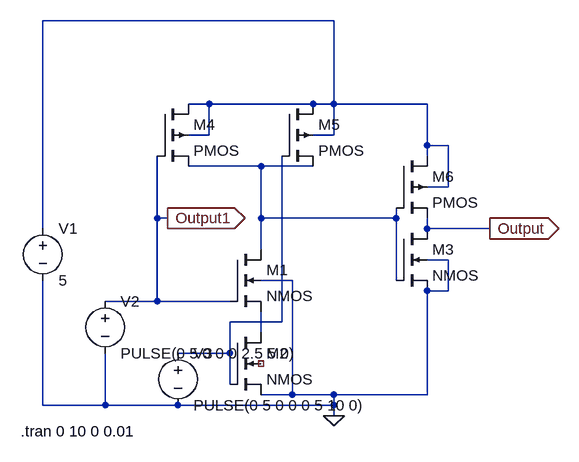
[diagram p0: schematic and.asc]
and.asc, the LTspice schematic file:
Version 4
SHEET 1 880 680
WIRE 256 -272 -192 -272
WIRE 64 -144 32 -144
WIRE 224 -144 64 -144
WIRE 256 -144 256 -272
WIRE 256 -144 224 -144
WIRE 400 -144 256 -144
WIRE 64 -96 64 -144
WIRE 64 -96 32 -96
WIRE 256 -96 256 -144
WIRE 256 -96 224 -96
WIRE 400 -80 400 -144
WIRE 432 -80 400 -80
WIRE 400 -64 400 -80
WIRE 144 -48 32 -48
WIRE 224 -48 144 -48
WIRE 432 -16 432 -80
WIRE 432 -16 400 -16
WIRE -16 32 -16 -64
WIRE 0 32 -16 32
WIRE 144 32 144 -48
WIRE 352 32 352 16
WIRE 352 32 144 32
WIRE -192 48 -192 -272
WIRE 400 48 400 32
WIRE 496 48 400 48
WIRE 144 80 144 32
WIRE 432 96 400 96
WIRE 192 128 144 128
WIRE 352 128 352 32
WIRE 432 144 432 96
WIRE 432 144 400 144
WIRE -16 160 -16 32
WIRE -16 160 -96 160
WIRE 96 160 -16 160
WIRE 176 192 176 -64
WIRE 176 192 96 192
WIRE 144 208 144 176
WIRE 96 240 96 192
WIRE 96 240 16 240
WIRE 96 288 96 240
WIRE 192 304 192 128
WIRE 192 304 144 304
WIRE 256 304 192 304
WIRE 400 304 400 144
WIRE 400 304 256 304
WIRE -192 320 -192 128
WIRE -96 320 -96 240
WIRE -96 320 -192 320
WIRE 16 320 -96 320
WIRE 256 320 256 304
WIRE 256 320 16 320
WIRE 256 336 256 320
FLAG 256 336 0
FLAG 496 48 Output
IOPIN 496 48 Out
FLAG 0 32 Output1
IOPIN 0 32 Out
SYMBOL nmos4 96 80 R0
SYMATTR InstName M1
SYMATTR Value2 l=0.000002 w=0.00000018
SYMBOL nmos4 96 208 R0
SYMATTR InstName M2
SYMATTR Value2 l=0.000002 w=0.00000018
SYMBOL nmos4 352 48 R0
SYMATTR InstName M3
SYMATTR Value2 l=0.000002 w=0.00000018
SYMBOL pmos4 -16 -144 R0
SYMATTR InstName M4
SYMATTR Value2 l=0.000006 w=0.00000018
SYMBOL pmos4 176 -144 R0
SYMATTR InstName M5
SYMATTR Value2 l=0.000006 w=0.00000018
SYMBOL pmos4 352 -64 R0
SYMATTR InstName M6
SYMATTR Value2 l=0.000006 w=0.00000018
SYMBOL voltage -192 32 R0
WINDOW 123 0 0 Left 0
WINDOW 39 0 0 Left 0
SYMATTR InstName V1
SYMATTR Value 5
SYMBOL voltage -96 144 R0
WINDOW 123 0 0 Left 0
WINDOW 39 0 0 Left 0
SYMATTR InstName V2
SYMATTR Value PULSE(0 5 0 0 0 2.5 5 0)
SYMBOL voltage 16 224 R0
WINDOW 123 0 0 Left 0
WINDOW 39 0 0 Left 0
SYMATTR InstName V3
SYMATTR Value PULSE(0 5 0 0 0 5 10 0)
TEXT -226 360 Left 2 !.tran 0 10 0 0.01

The netlist it stands for:
* and.asc
M1 N002 Output1 N004 0 NMOS l=0.000002 w=0.00000018
M2 N004 N003 0 NC_01 NMOS l=0.000002 w=0.00000018
M3 Output N002 0 0 NMOS l=0.000002 w=0.00000018
M4 N001 Output1 N002 N001 PMOS l=0.000006 w=0.00000018
M5 N001 N003 N002 N001 PMOS l=0.000006 w=0.00000018
M6 N001 N002 Output N001 PMOS l=0.000006 w=0.00000018
V1 N001 0 5
V2 Output1 0 PULSE(0 5 0 0 0 2.5 5 0)
V3 N003 0 PULSE(0 5 0 0 0 5 10 0)
.model NMOS NMOS
.model PMOS PMOS
.lib standard.mos
.tran 0 10 0 0.01
.backanno
.end